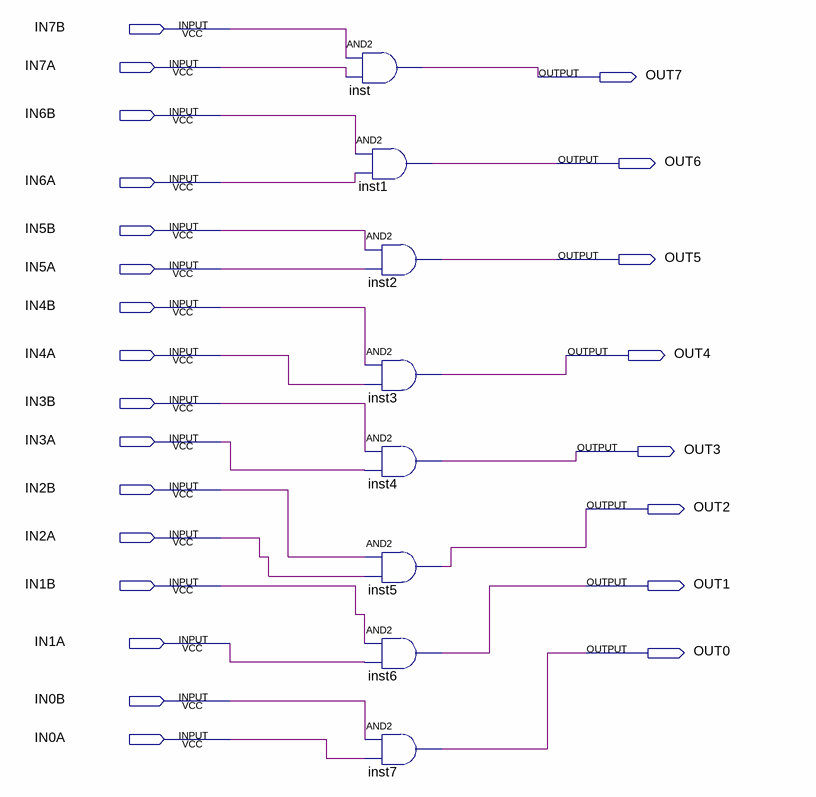
[diagram p0: schematic sheet]
// Quartus schematic AND8_2.bdf as structural Verilog: 8 symbols, 24 pins
module AND8_2 (
  input  IN7B,
  input  IN7A,
  input  IN6B,
  input  IN6A,
  input  IN5B,
  input  IN5A,
  input  IN4B,
  input  IN4A,
  input  IN3B,
  input  IN3A,
  input  IN2B,
  input  IN2A,
  input  IN1B,
  input  IN1A,
  input  IN0B,
  input  IN0A,
  output OUT7,
  output OUT6,
  output OUT5,
  output OUT4,
  output OUT3,
  output OUT2,
  output OUT1,
  output OUT0
);

  and inst (OUT7, IN7B, IN7A);
  and inst1 (OUT6, IN6B, IN6A);
  and inst2 (OUT5, IN5B, IN5A);
  and inst3 (OUT4, IN4B, IN4A);
  and inst4 (OUT3, IN3B, IN3A);
  and inst5 (OUT2, IN2B, IN2A);
  and inst6 (OUT1, IN1B, IN1A);
  and inst7 (OUT0, IN0B, IN0A);
endmodule
